# Altium schematic sheet ADC-Breakout.SchDoc
size A4
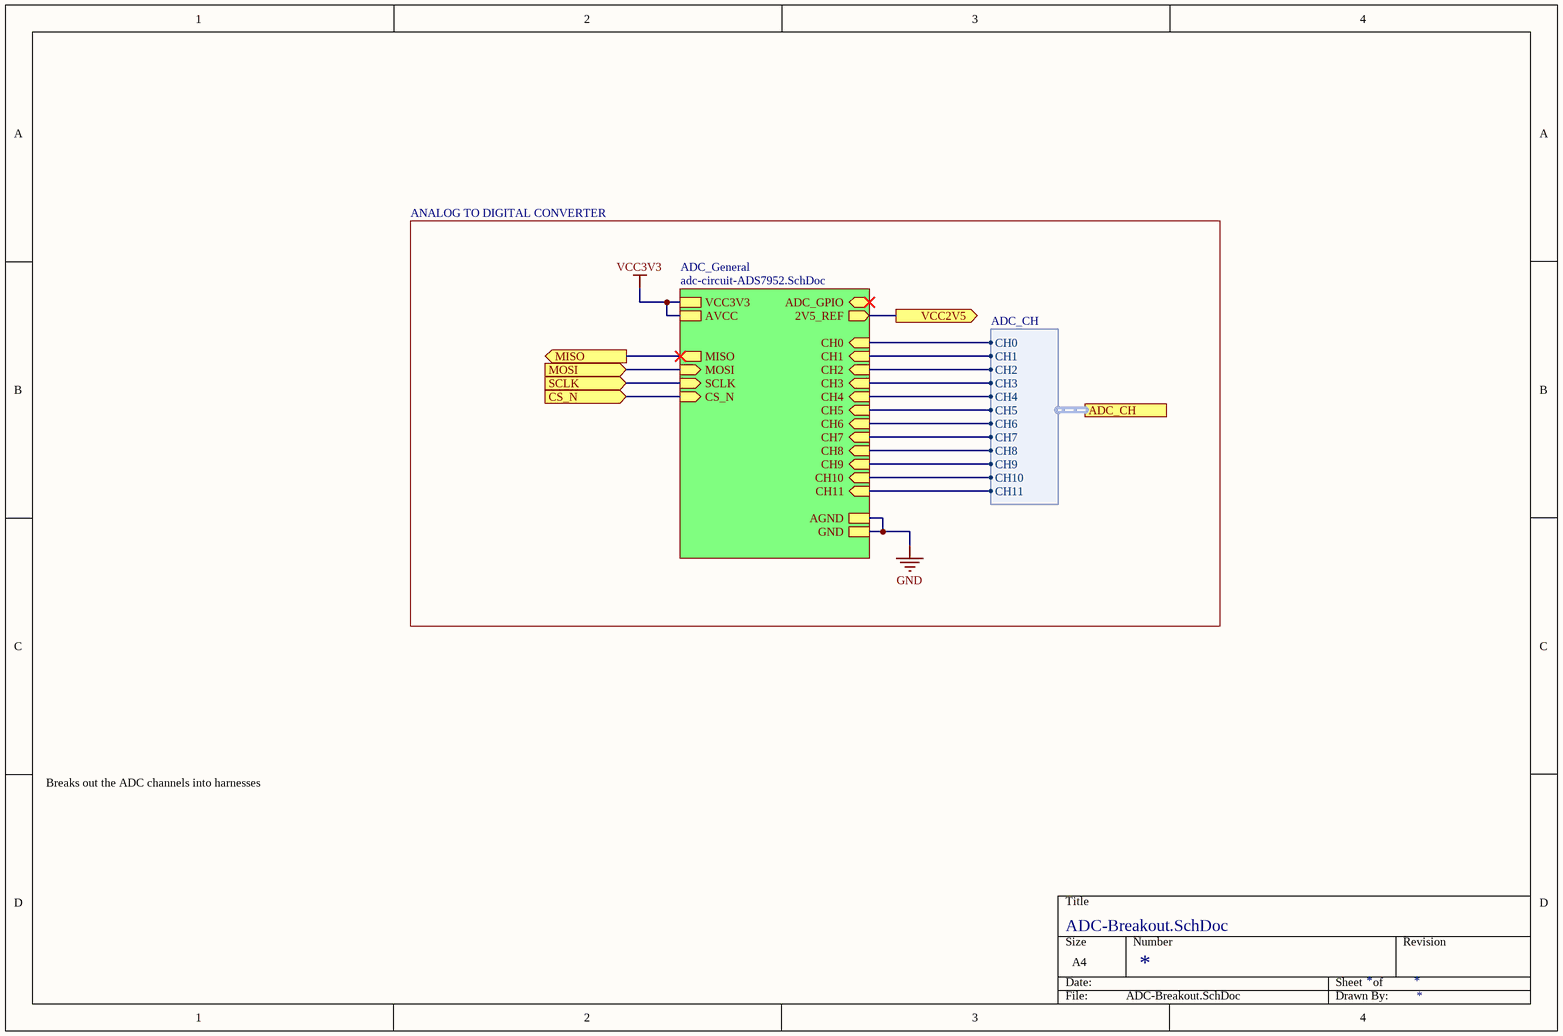
[diagram p0: ADC-Breakout.SchDoc]

## Sub-sheets
ADC_General = adc-circuit-ADS7952.SchDoc: ADC_GPIO (bidir), CS_N (in), SCLK (in), MOSI (in), CH9 (in), CH7 (in), CH8 (in), MISO (out), CH10 (in), CH5 (in), CH1 (in), CH4 (in), CH3 (in), CH11 (in), CH0 (in), VCC3V3, 2V5_REF (out), CH2 (in), AVCC, AGND, CH6 (in), GND

## Ports
ADC_CH (harness ADC_CH), CS_N (in), MISO (out), MOSI (in), SCLK (in), VCC2V5 (out)

## Harnesses
ADC_CH: CH0, CH1, CH2, CH3, CH4, CH5, CH6, CH7, CH8, CH9, CH10, CH11

## Nets
GND: sheet ADC_General/AGND, sheet ADC_General/GND
VCC3V3: sheet ADC_General/VCC3V3, sheet ADC_General/AVCC
CS_N: port CS_N, sheet ADC_General/CS_N
MISO: port MISO, sheet ADC_General/MISO
MOSI: port MOSI, sheet ADC_General/MOSI
SCLK: port SCLK, sheet ADC_General/SCLK
VCC2V5: port VCC2V5, sheet ADC_General/2V5_REF
(unnamed): sheet ADC_General/CH9, port ADC_CH.CH9
(unnamed): sheet ADC_General/CH7, port ADC_CH.CH7
(unnamed): sheet ADC_General/CH8, port ADC_CH.CH8
(unnamed): sheet ADC_General/CH10, port ADC_CH.CH10
(unnamed): sheet ADC_General/CH5, port ADC_CH.CH5
(unnamed): sheet ADC_General/CH1, port ADC_CH.CH1
(unnamed): sheet ADC_General/CH4, port ADC_CH.CH4
(unnamed): sheet ADC_General/CH3, port ADC_CH.CH3
(unnamed): sheet ADC_General/CH11, port ADC_CH.CH11
(unnamed): sheet ADC_General/CH0, port ADC_CH.CH0
(unnamed): sheet ADC_General/CH2, port ADC_CH.CH2
(unnamed): sheet ADC_General/CH6, port ADC_CH.CH6

## Notes on the sheet
- ANALOG TO DIGITAL CONVERTER
- Breaks out the ADC channels into harnesses